# Altium schematic sheet MotorDrive1.SchDoc
size A4
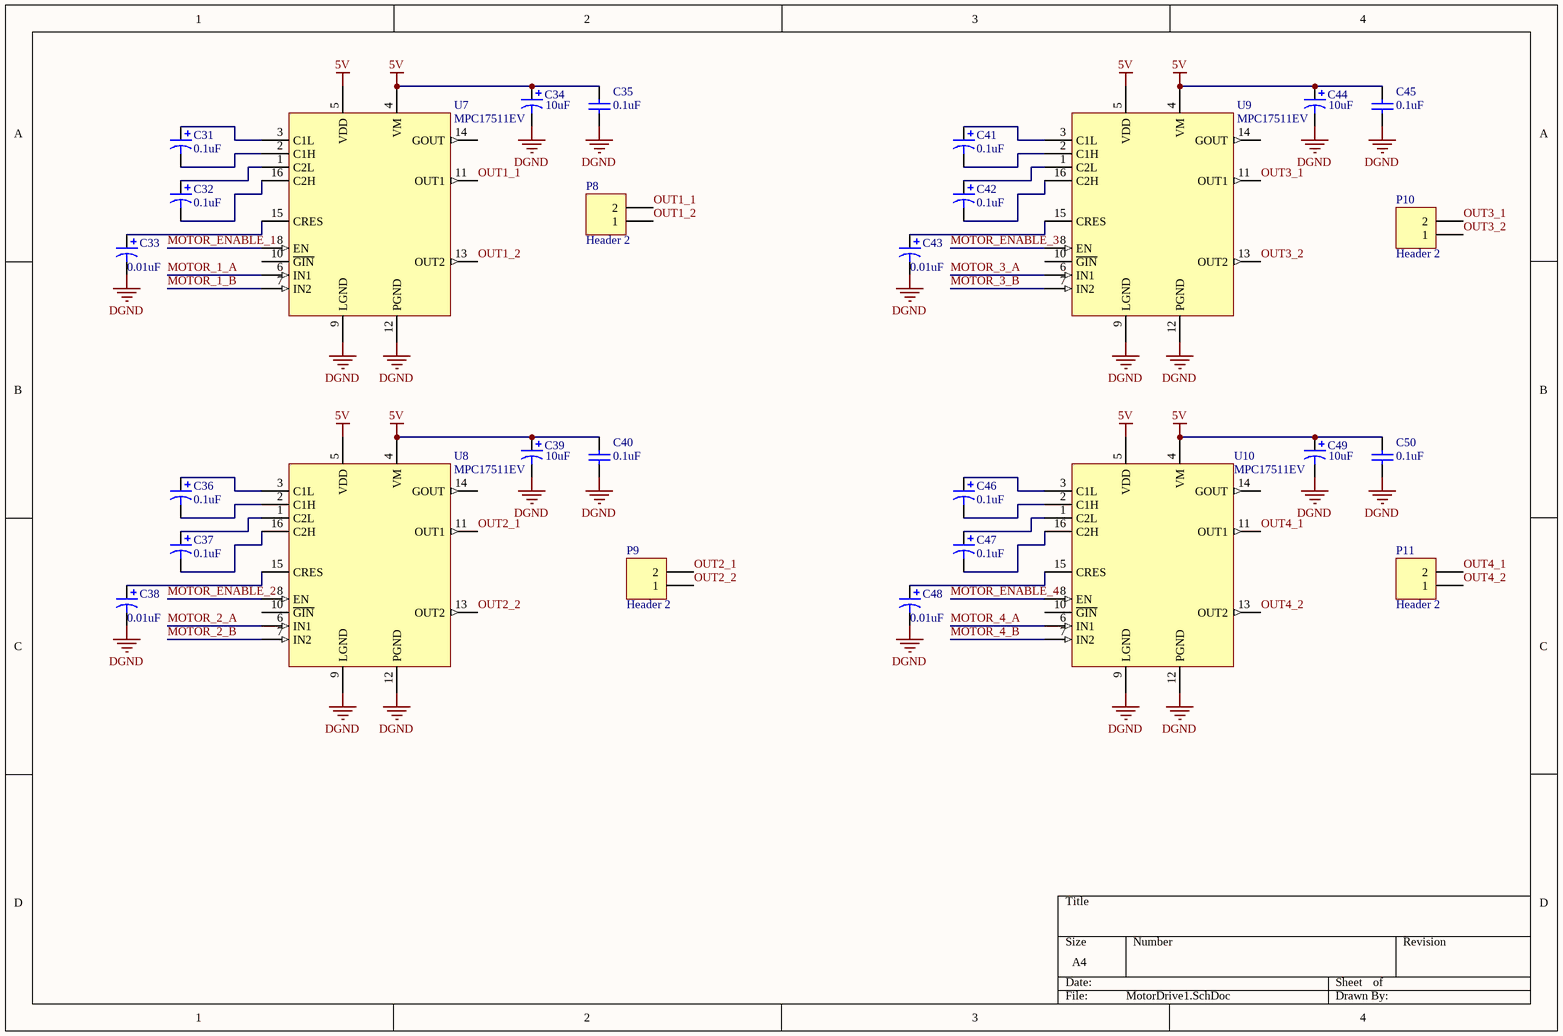
[diagram p0: MotorDrive1.SchDoc]

## Parts
C31  0.1uF  [0402]
C32  0.1uF  [0402]
C33  0.01uF  [1608[0603]]
C34  10uF  [1608[0603]]
C35  0.1uF  [1608[0603]]
C36  0.1uF  [0402]
C37  0.1uF  [0402]
C38  0.01uF  [1608[0603]]
C39  10uF  [1608[0603]]
C40  0.1uF  [1608[0603]]
C41  0.1uF  [0402]
C42  0.1uF  [0402]
C43  0.01uF  [1608[0603]]
C44  10uF  [1608[0603]]
C45  0.1uF  [1608[0603]]
C46  0.1uF  [0402]
C47  0.1uF  [0402]
C48  0.01uF  [1608[0603]]
C49  10uF  [1608[0603]]
C50  0.1uF  [1608[0603]]
P8  Header 2  [HDR1X2]
P9  Header 2  [HDR1X2]
P10  Header 2  [HDR1X2]
P11  Header 2  [HDR1X2]
U7  MPC17511EV  [MPC_motor_drive]
U8  MPC17511EV  [MPC_motor_drive]
U9  MPC17511EV  [MPC_motor_drive]
U10  MPC17511EV  [MPC_motor_drive]

## Nets
5V: C34.1 C35.2 C39.1 C40.2 C44.1 C45.2 C49.1 C50.2 U7.4(VM) U7.5(VDD) U8.4(VM) U8.5(VDD) U9.4(VM) U9.5(VDD) U10.4(VM) U10.5(VDD)
DGND: C33.2 C34.2 C35.1 C38.2 C39.2 C40.1 C43.2 C44.2 C45.1 C48.2 C49.2 C50.1 U7.9(LGND) U7.12(PGND) U8.9(LGND) U8.12(PGND) U9.9(LGND) U9.12(PGND) U10.9(LGND) U10.12(PGND)
MOTOR_1_A: U7.6(IN1)
MOTOR_1_B: U7.7(IN2)
MOTOR_2_A: U8.6(IN1)
MOTOR_2_B: U8.7(IN2)
MOTOR_3_A: U9.6(IN1)
MOTOR_3_B: U9.7(IN2)
MOTOR_4_A: U10.6(IN1)
MOTOR_4_B: U10.7(IN2)
MOTOR_ENABLE_1: U7.8(EN)
MOTOR_ENABLE_2: U8.8(EN)
MOTOR_ENABLE_3: U9.8(EN)
MOTOR_ENABLE_4: U10.8(EN)
OUT1_1: P8.2 U7.11(OUT1)
OUT1_2: P8.1 U7.13(OUT2)
OUT2_1: P9.2 U8.11(OUT1)
OUT2_2: P9.1 U8.13(OUT2)
OUT3_1: P10.2 U9.11(OUT1)
OUT3_2: P10.1 U9.13(OUT2)
OUT4_1: P11.2 U10.11(OUT1)
OUT4_2: P11.1 U10.13(OUT2)
NetC31_1: C31.1 U7.3(C1L)
NetC31_2: C31.2 U7.2(C1H)
NetC32_1: C32.1 U7.1(C2L)
NetC32_2: C32.2 U7.16(C2H)
NetC33_1: C33.1 U7.15(CRES)
NetC36_1: C36.1 U8.3(C1L)
NetC36_2: C36.2 U8.2(C1H)
NetC37_1: C37.1 U8.1(C2L)
NetC37_2: C37.2 U8.16(C2H)
NetC38_1: C38.1 U8.15(CRES)
NetC41_1: C41.1 U9.3(C1L)
NetC41_2: C41.2 U9.2(C1H)
NetC42_1: C42.1 U9.1(C2L)
NetC42_2: C42.2 U9.16(C2H)
NetC43_1: C43.1 U9.15(CRES)
NetC46_1: C46.1 U10.3(C1L)
NetC46_2: C46.2 U10.2(C1H)
NetC47_1: C47.1 U10.1(C2L)
NetC47_2: C47.2 U10.16(C2H)
NetC48_1: C48.1 U10.15(CRES)

Not connected (* = marked no-connect by the designer): U7 10(~{GIN}) 14(GOUT); U8 10(~{GIN}) 14(GOUT); U9 10(~{GIN}) 14(GOUT); U10 10(~{GIN}) 14(GOUT)

## Library data of the parts
C31-C34 C36-C39 C41-C44 C46-C49 = Cap Pol1: Polarized Capacitor (Radial); Published: 8-Jun-2000; LatestRevisionDate: 17-Jul-2002; LatestRevisionNote: Re-released for DXP Platform.; PackageReference: RB7.6-15; Publisher: Altium Limited; PackageDescription: Polarized Capacitor (Radial); 2 Leads
  C31 C32 C36 C37 C41 C42 C46 C47: Value: 0.1uF
  C33 C38 C43 C48: Value: 0.01uF
  C34 C39 C44 C49: Value: 10uF
C35 C40 C45 C50 = Cap: Capacitor; Published: 8-Jun-2000; LatestRevisionDate: 17-Jul-2002; LatestRevisionNote: Re-released for DXP Platform.; PackageReference: RAD-0.3; Publisher: Altium Limited; PackageDescription: Radial Cap, Thru-Hole; 2 Leads; 0.3 in Pin Spacing; Value: 0.1uF
P8-P11 = Header 2: Header, 2-Pin; LatestRevisionDate: 17-Jul-2002; LatestRevisionNote: Re-released for DXP Platform.; Publisher: Altium Limited
U7-U10 = MPC17511EV: IC MOTOR DRIVER PAR 16VMFP; Mfr 1: NXP USA; Mfr 1 PN: MPC17511EV; Notes: *